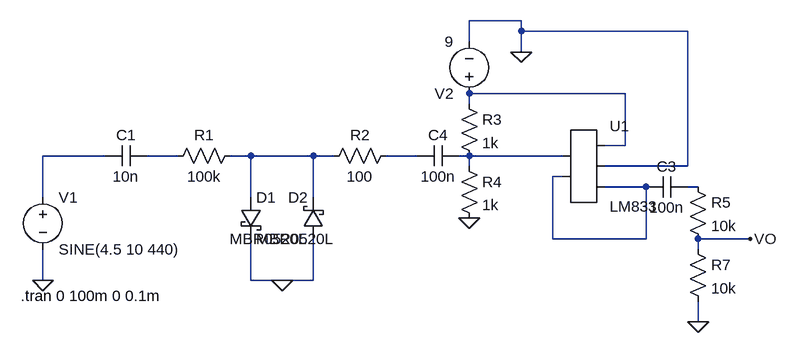
[diagram p0: schematic Draft1.asc]
Draft1.asc, the LTspice schematic file:
Version 4
SHEET 1 1204 680
WIRE 800 -80 720 -80
WIRE 800 -64 800 -80
WIRE 1056 -64 800 -64
WIRE 720 -48 720 -80
WIRE 800 -32 800 -64
WIRE 960 32 720 32
WIRE 720 48 720 32
WIRE 960 112 960 32
WIRE 960 112 928 112
WIRE 160 128 64 128
WIRE 272 128 224 128
WIRE 384 128 352 128
WIRE 480 128 384 128
WIRE 512 128 480 128
WIRE 640 128 592 128
WIRE 720 128 704 128
WIRE 864 128 720 128
WIRE 720 144 720 128
WIRE 1056 144 1056 -64
WIRE 1056 144 928 144
WIRE 864 160 848 160
WIRE 992 176 928 176
WIRE 1072 176 1056 176
WIRE 64 192 64 128
WIRE 384 192 384 128
WIRE 480 192 480 128
WIRE 848 256 848 160
WIRE 992 256 992 176
WIRE 992 256 848 256
WIRE 1152 256 1072 256
WIRE 1072 272 1072 256
WIRE 64 320 64 272
WIRE 384 320 384 256
WIRE 432 320 384 320
WIRE 480 320 480 256
WIRE 480 320 432 320
WIRE 1072 384 1072 352
FLAG 64 320 0
FLAG 432 320 0
FLAG 720 224 0
FLAG 800 -32 0
FLAG 1072 384 0
FLAG 1152 256 VO
SYMBOL voltage 64 176 R0
WINDOW 123 0 0 Left 0
WINDOW 39 0 0 Left 0
SYMATTR InstName V1
SYMATTR Value SINE(4.5 10 440)
SYMBOL cap 224 112 R90
WINDOW 0 0 32 VBottom 2
WINDOW 3 32 32 VTop 2
SYMATTR InstName C1
SYMATTR Value 10n
SYMBOL res 368 112 R90
WINDOW 0 0 56 VBottom 2
WINDOW 3 32 56 VTop 2
SYMATTR InstName R1
SYMATTR Value 100k
SYMBOL schottky 368 192 R0
SYMATTR InstName D1
SYMATTR Value MBR0520L
SYMATTR Description Diode
SYMATTR Type diode
SYMBOL schottky 496 256 R180
WINDOW 0 24 64 Left 2
WINDOW 3 24 0 Left 2
SYMATTR InstName D2
SYMATTR Value MBR0520L
SYMATTR Description Diode
SYMATTR Type diode
SYMBOL res 608 112 R90
WINDOW 0 0 56 VBottom 2
WINDOW 3 32 56 VTop 2
SYMATTR InstName R2
SYMATTR Value 100
SYMBOL AutoGenerated\\LM833 896 144 R0
SYMATTR InstName U1
SYMBOL res 704 32 R0
SYMATTR InstName R3
SYMATTR Value 1k
SYMBOL res 704 128 R0
SYMATTR InstName R4
SYMATTR Value 1k
SYMBOL voltage 720 48 R180
WINDOW 123 0 0 Left 0
WINDOW 39 0 0 Left 0
SYMATTR InstName V2
SYMATTR Value 9
SYMBOL res 1056 160 R0
SYMATTR InstName R5
SYMATTR Value 10k
SYMBOL res 1056 256 R0
SYMATTR InstName R7
SYMATTR Value 10k
SYMBOL cap 1056 160 R90
WINDOW 0 0 32 VBottom 2
WINDOW 3 32 32 VTop 2
SYMATTR InstName C3
SYMATTR Value 100n
SYMBOL cap 704 112 R90
WINDOW 0 0 32 VBottom 2
WINDOW 3 32 32 VTop 2
SYMATTR InstName C4
SYMATTR Value 100n
TEXT 30 344 Left 2 !.tran 0 100m 0 0.1m

The netlist it stands for:
* Draft1.asc
V1 N002 0 SINE(4.5 10 440)
C1 N003 N002 10n
R1 N004 N003 100k
D1 N004 0 MBR0520L
D2 0 N004 MBR0520L
R2 N005 N004 100
* U1: LM833 (symbol AutoGenerated\LM833 not available, pins judged from their places): pin1=N006 pin2=N007 pin3=N001 pin4=0 pin5=N007
R3 N001 N006 1k
R4 N006 0 1k
V2 N001 0 9
R5 N008 VO 10k
R7 VO 0 10k
C3 N008 N007 100n
C4 N006 N005 100n
.model D D
.lib standard.dio
.tran 0 100m 0 0.1m
.backanno
.end